# EAGLE design s-isp (EAGLE 7.5.0)
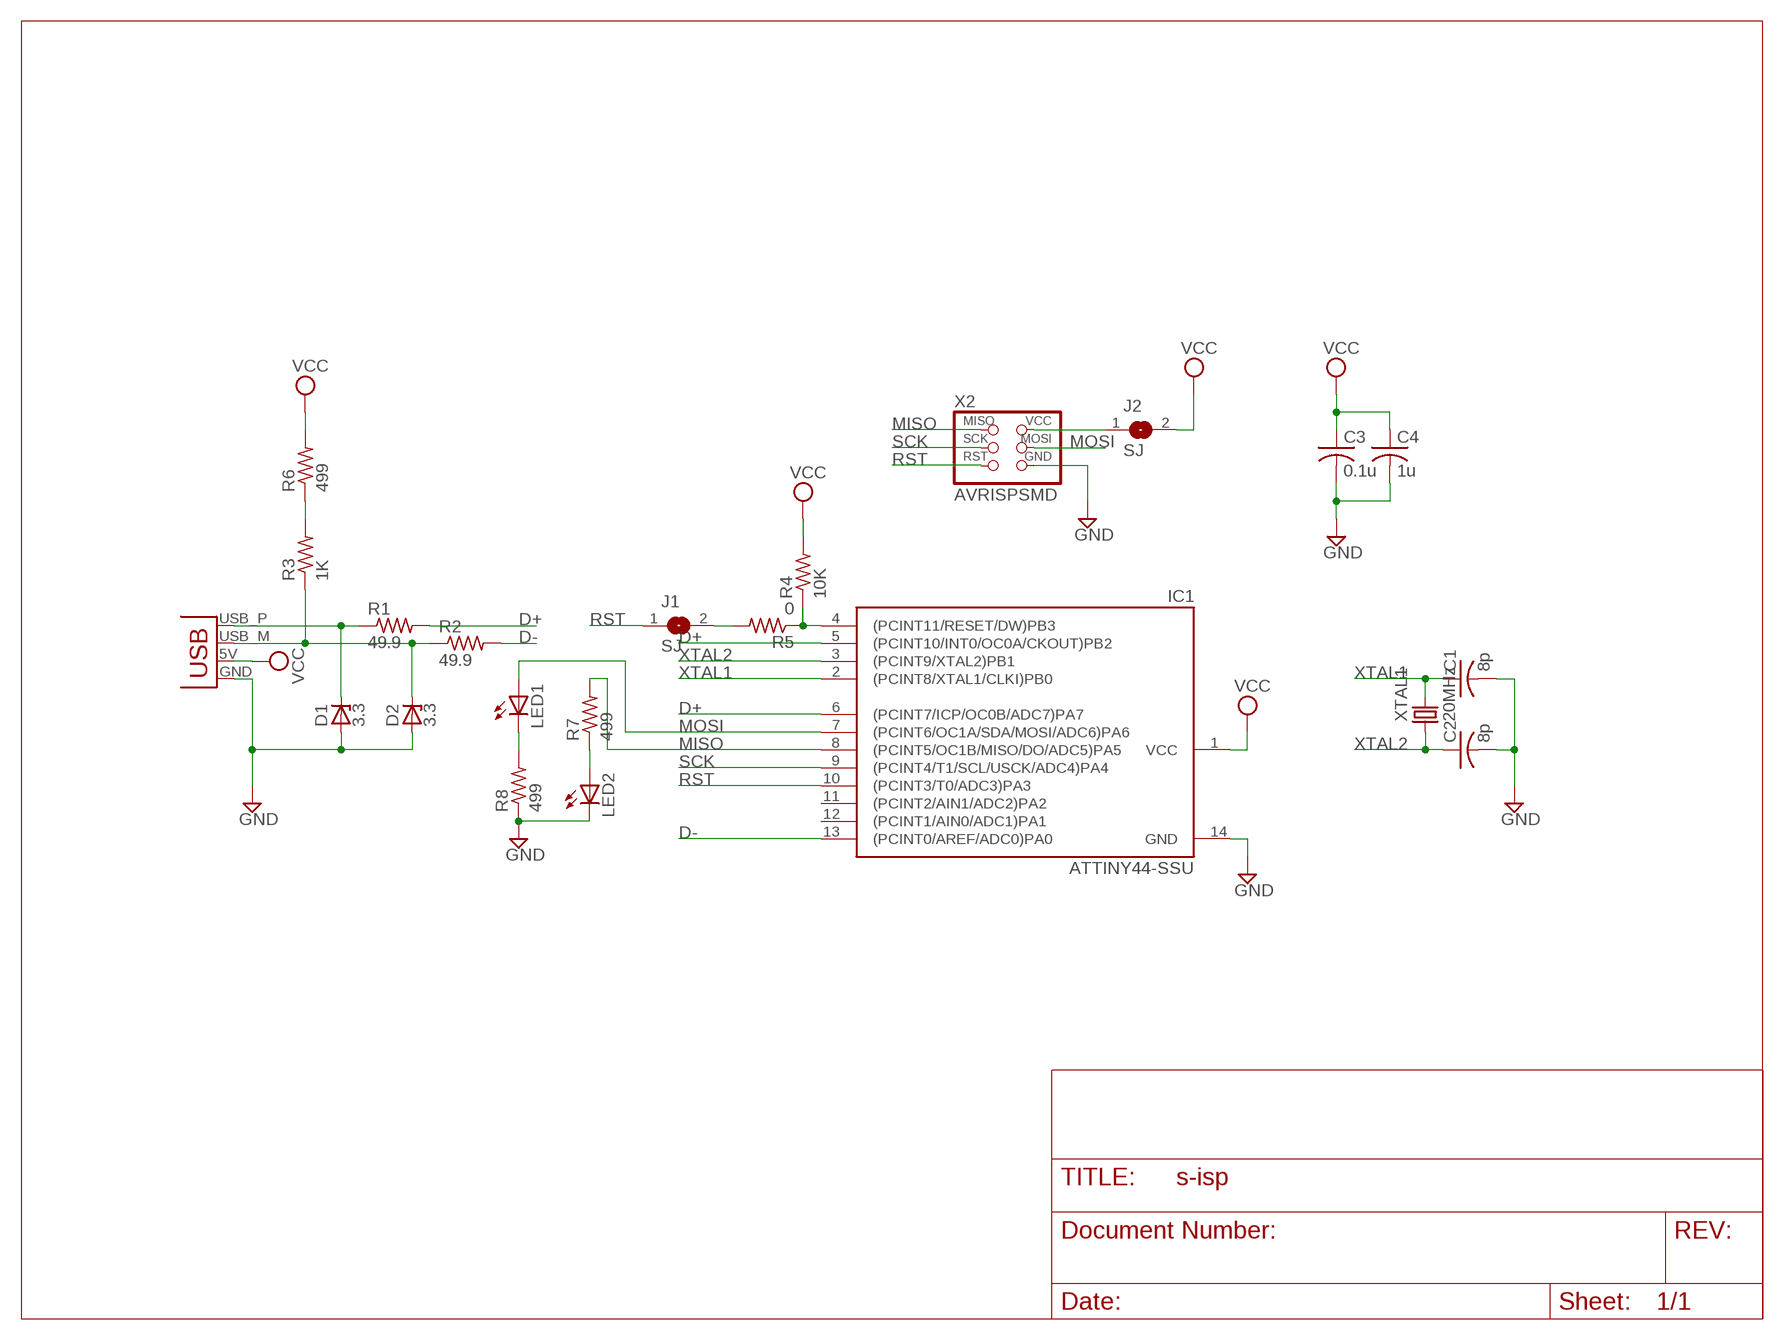
[diagram p0: schematic, sheet 1]

## Parts
C1  8p  C-USC1206  [C1206]
C2  8p  C-USC1206  [C1206]
C3  0.1u  C-USC1206  [C1206]
C4  1u  C-USC1206  [C1206]
D1  3.3  ZENER_DIODESOD123  [SOD123]
D2  3.3  ZENER_DIODESOD123  [SOD123]
IC1  ATTINY44-SSU  [SOIC14]
J1  SJ  SOLDER_JUMPER  [SJFAB]
J2  SJ  SOLDER_JUMPER  [SJFAB]
LED1  LEDSMT1206  [1206]
LED2  LEDSMT1206  [1206]
R1  49.9  R-US_R1206  [R1206]
R2  49.9  R-US_R1206  [R1206]
R3  1K  R-US_R1206  [R1206]
R4  10K  R-US_R1206  [R1206]
R5  0  R-US_R1206  [R1206]
R6  499  R-US_R1206  [R1206]
R7  499  R-US_R1206  [R1206]
R8  499  R-US_R1206  [R1206]
X1  USBPCB  [USB-A-PCB]
X2  AVRISPSMD  [2X03SMD]
XTAL1  20MHz  CRYSTAL  [2-SMD-5X3MM]

## Nets
D+: IC1.5((PCINT10/INT0/OC0A/CKOUT)PB2) IC1.6((PCINT7/ICP/OC0B/ADC7)PA7) R1.2
D-: IC1.13((PCINT0/AREF/ADC0)PA0) R2.2
GND: C1.2 C2.2 C3.2 C4.2 D1.ANODE D2.ANODE IC1.14(GND) LED2.C R8.1 X1.GND X2.6(GND)
MISO: IC1.8((PCINT5/OC1B/MISO/DO/ADC5)PA5) R7.2 X2.1(MISO)
MOSI: IC1.7((PCINT6/OC1A/SDA/MOSI/ADC6)PA6) LED1.A X2.4(MOSI)
N$1: D1.CATHODE R1.1 X1.USB_P(D+)
N$2: D2.CATHODE R2.1 R3.1 X1.USB_M(D-)
N$3: J1.2 R5.2
N$4: J2.1 X2.2(VCC)
N$5: IC1.4((PCINT11/RESET/DW)PB3) R4.1 R5.1
N$6: R3.2 R6.1
N$7: LED1.C R8.2
N$8: LED2.A R7.1
RST: IC1.10((PCINT3/T0/ADC3)PA3) J1.1 X2.5(RST)
SCK: IC1.9((PCINT4/T1/SCL/USCK/ADC4)PA4) X2.3(SCK)
VCC: C3.1 C4.1 IC1.1(VCC) J2.2 R4.2 R6.2 X1.5V(VBUS)
XTAL1: C1.1 IC1.2((PCINT8/XTAL1/CLKI)PB0) XTAL1.P$2
XTAL2: C2.1 IC1.3((PCINT9/XTAL2)PB1) XTAL1.P$1
Unconnected: IC1.11((PCINT2/AIN1/ADC2)PA2) IC1.12((PCINT1/AIN0/ADC1)PA1)

## Library data of the parts
C1-C4 = rcl:C-US: CAPACITOR, American symbol
D1 D2 = fab:ZENER_DIODE: zener diode
IC1 = fab:ATTINY44
J1 J2 = fab:SOLDER_JUMPER
LED1 LED2 = led:LED: LED OSRAM: - CHIPLED LG R971, LG N971, LY N971, LG Q971, LY Q971, LO R971, LY R971 LH N974, LH R974 LS Q976, LO Q976, LY Q976 LO Q996 - Hyper CHIPLED LW Q18S LB Q993, LB Q99A, LB R99A - SideLED LS A670, LO A670, LY A670, LG A670, LP A670 LB A673, LV A673, LT A673, LW A673 LH A674 LY A675 LS A676, LA A676, LO A676, LY A676, LW A676 LS A679, LY A679, LG A679 - Hyper Micro SIDELED® LS Y876, LA Y876, LO Y876, LY Y876 LT Y87S - SmartLED LW L88C, LW L88S LB L89C, LB L89S, LG L890 LS L89K, LO L89K, LY L89K LS L896, LA L896, LO L896, LY L896 - TOPLED LS T670, LO T670, LY T670, LG T670, LP T670 LSG T670, LSP T670, LSY T670, LOP T670, LYG T670 LG T671, LOG T671, LSG T671 LB T673, LV T673, LT T673, LW T673 LH T674 LS T676, LA T676, LO T676, LY T676, LB T676, LH T676, LSB T676, LW T676 LB T67C, LV T67C, LT T67C, LS T67K, LO T67K, LY T67K, LW E67C LS E67B, LA E67B, LO E67B, LY E67B, LB E67C, LV E67C, LT E67C LW T67C LS T679, LY T679, LG T679 LS T770, LO T770, LY T770, LG T770, LP T770 LB T773, LV T773, LT T773, LW T773 LH T774 LS E675, LA E675, LY E675, LS T675 LS T776, LA T776, LO T776, LY T776, LB T776 LHGB T686 LT T68C, LB T68C - Hyper Mini TOPLED® LB M676 - Mini TOPLED Santana® LG M470 LS M47K, LO M47K, LY M47K Source: http://www.osram.convergy.de LUXEON: - LUMILED® LXK2-PW12-R00, LXK2-PW12-S00, LXK2-PW14-U00, LXK2-PW14-V00 LXK2-PM12-R00, LXK2-PM12-S00, LXK2-PM14-U00 LXK2-PE12-Q00, LXK2-PE12-R00, LXK2-PE12-S00, LXK2-PE14-T00, LXK2-PE14-U00 LXK2-PB12-K00, LXK2-PB12-L00, LXK2-PB12-M00, LXK2-PB14-N00, LXK2-PB14-P00, LXK2-PB14-Q00 LXK2-PR12-L00, LXK2-PR12-M00, LXK2-PR14-Q00, LXK2-PR14-R00 LXK2-PD12-Q00, LXK2-PD12-R00, LXK2-PD12-S00 LXK2-PH12-R00, LXK2-PH12-S00 LXK2-PL12-P00, LXK2-PL12-Q00, LXK2-PL12-R00 Source: www.luxeon.com KINGBRIGHT: KA-3528ASYC Source: www.kingbright.com
R1-R8 = rcl:R-US_: RESISTOR, American symbol
X1 = SparkFun:USB: USB Connectors USB-B-PTH is fully proven SKU : PRT-00139 USB-miniB is fully proven SKU : PRT-00587 USB-A-PCB is untested. USB-A-H is throughly reviewed, but untested. Spark Fun Electronics SKU : PRT-00437 USB-B-SMT is throughly reviewed, but untested. Needs silkscreen touching up. USB-A-S has not been used/tested USB-MB-H has not been used/tested
X2 = fab:AVRISP
XTAL1 = fab:CRYSTAL

## Board
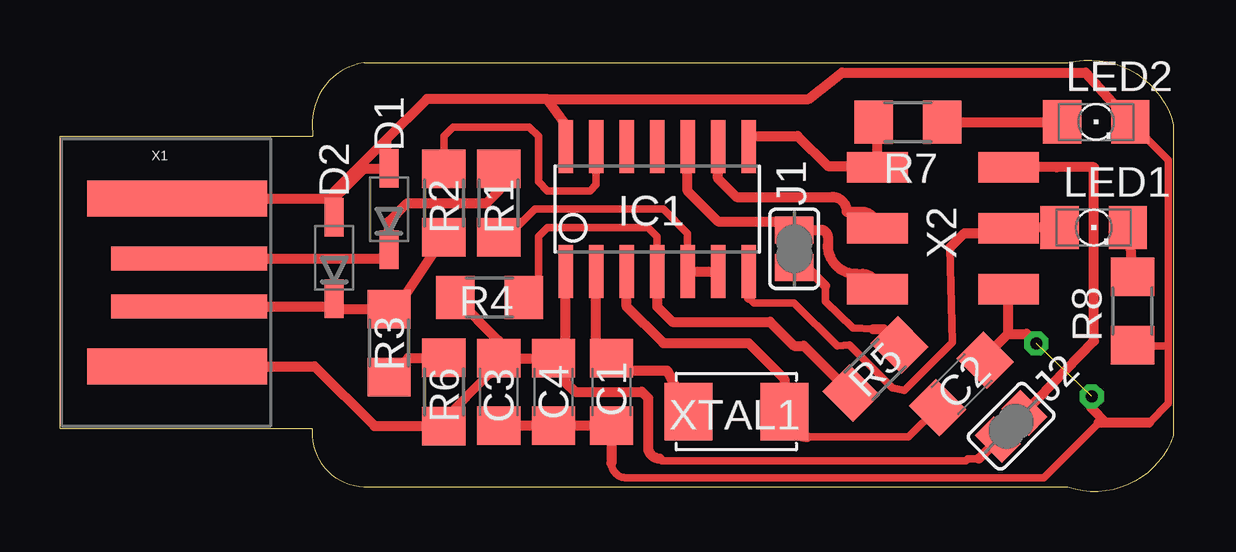
[diagram p1: board, top side]

Size 46.41 x 18.01 mm. Coordinates in mm from the lower left corner, seen from the top.
Outline: 0,2.64 10.54,2.64 10.54,2.51 arc90 12.67,0.18 42.01,0.18 arc90 46.41,2.36 46.41,15.31 arc90 42.01,17.89 12.67,17.89 arc90 10.54,14.96 10.54,14.83 0,14.83 0,2.64
Copper layers (1*16): Top 0.035mm / dielectric 1.5mm / Bottom 0.035mm
Design rules "fab": minimum track width 12mil, minimum drill 0.8mm, track to track 15.5mil, track to pad 15.5mil, pad to pad 15mil, via to via 15mil, smd to smd 10mil, copper to edge 0mil, drill to drill 1mm, minimum pad ring 0.2mm, minimum via ring 0.2mm, stop-mask expansion 4mil, vias tented up to drill 0mil, thermal gap 1mm
tRestrict: 4 lines

### Footprints (pad centres in the part's own frame; a part is rotated, then mirrored left to right if it is on the bottom)
C1206 = smd 1.6 x 1.8: 1 -1.4,0; 2 1.4,0
SOD123 = smd 1.6 x 0.8: ANODE 1.7,0; CATHODE -1.7,0
SOIC14 = smd 0.61 x 2.21: 1 -3.81,-2.603; 2 -2.54,-2.603; 3 -1.27,-2.603; 4 0,-2.603; 5 1.27,-2.603; 6 2.54,-2.603; 7 3.81,-2.603; 8 3.81,2.603; 9 2.54,2.603; 10 1.27,2.603; 11 0,2.603; 12 -1.27,2.603; 13 -2.54,2.603; 14 -3.81,2.603
SJFAB = smd 1.118 x 1.6: 1 -0.787,0; 2 0.787,0
1206 = smd 1.6 x 1.803: A -1.422,0; C 1.422,0
R1206 = smd 1.6 x 1.803: 1 -1.422,0; 2 1.422,0
USB-A-PCB = smd 7.5 x 1.5: 5V -0.2,-3.5; GND -0.2,3.5 | smd 6.5 x 1: USB_M 0.3,-1; USB_P 0.3,1
2X03SMD = smd 2.54 x 1.27: 1 -2.54,2.54; 2 2.92,2.54; 3 -2.54,0; 4 2.92,0; 5 -2.54,-2.54; 6 2.92,-2.54
2-SMD-5X3MM = smd 2 x 2.4: P$1 -2,0; P$2 2,0

### Placement (x,y rotation side)
C1  22.99,4.16 270 top
C2  37.58,4.49 45 top
C3  18.29,4.16 270 top
C4  20.57,4.16 270 top
D1  13.72,11.78 90 top
D2  11.43,9.75 90 top
IC1  24.89,11.78 0 top
J1  30.61,10.13 270 top
J2  39.65,2.73 225 top
LED1  43.09,11.01 0 top
LED2  43.19,15.42 0 top
R1  18.29,12.04 270 top
R2  16,12.04 90 top
R3  13.72,6.19 270 top
R4  17.91,8.1 180 top
R5  33.99,5.11 45 top
R6  16,4.16 270 top
R7  35.34,15.41 180 top
R8  44.7,7.53 90 top
X1  5.08,8.73 0 top
X2  36.62,10.99 0 top
XTAL1  28.19,3.34 180 top

### Tracks (layer width: path | path; a pad name or v marks a point on that pad's centre or on a via)
D+
  Top 0.305: 18.64,10.61 19.81,11.78 25.15,11.78 26.16,10.77 IC1.5
  Top 0.406: IC1.5 IC1.6 | R1.2 18.64,10.61
D-
  Top 0.305: IC1.13 22.35,12.8 22.1,12.54 20.32,12.54 19.94,12.93 19.94,14.83 19.56,15.21 16.38,15.21 16,14.83 R2.2
GND  (via drill 0.5 pad 0.61)  (1 unrouted)
  Top 0.305: 22.99,1.19 arc90 23.6,0.58 41,0.58 43.3,2.88 | 45.4,2.88 46.2,3.68 46.2,6.08 | LED2.C 46.2,13.83 46.2,6.08 | R8.1 44.74,6.08 46.2,6.08
  Top 0.406: X1.GND 11.43,12.23 | 11.43,12.23 D2.ANODE 11.43,12.51 13.6,14.68 | 11.43,12.23 12.68,13.48 D1.ANODE 13.6,13.6 13.6,14.68 | C3.2 C4.2 C1.2 22.99,1.19 | 39.67,8.57 arc90 X2.6 39.5,8.41 39.5,6.58 | 39.5,6.58 38.52,5.6 C2.2 | IC1.14 21.1,14.4 21.1,15.28 20.3,16.38 | 20.3,16.38 15.3,16.38 13.6,14.68 | 20.3,16.38 31.2,16.38 32.6,17.48 42.75,17.48 LED2.C | 45.4,2.88 43.6,2.88 | 43.6,2.88 43.3,2.88 | v43,3.98 43,3.48 43.6,2.88 | 39.5,6.58 40.3,6.58 v40.7,6.18
MISO
  Top 0.406: IC1.8 28.7,14.83 30.75,14.83 32,13.58 34.03,13.58 X2.1 34.08,15.55 R7.2
MOSI
  Top 0.305: 28.7,8.1 28.92,7.88 30.6,7.88 32.4,6.08 32.9,6.13 34.7,4.33 35.2,4.23 37.2,6.23 37.1,10.18
  Top 0.406: 28.7,8.99 IC1.7 28.7,8.1 | LED1.A 39.57,11.01 arc90 X2.4 39.33,10.78 37.7,10.78 37.1,10.18
N$1
  Top 0.406: D1.CATHODE 13.56,10.24 | X1.USB_P 13.37,9.73 D1.CATHODE | R1.1 18.29,12.54 17.78,12.04 14.48,12.04 13.72,11.27 D1.CATHODE
N$2
  Top 0.406: X1.USB_M 11.11,7.73 D2.CATHODE 11.43,7.62 R3.1 14.02,7.62 R2.1
N$3
  Top 0.305: 31.9,8.58 31.9,7.93 33.05,6.83 33.9,6.78
  Top 0.406: J1.2 31.14,9.34 31.9,8.58 | 33.9,6.78 34.33,6.78 R5.2
N$4
  Top 0.406: J2.1 43.1,6.28 43.1,13.53 41.55,13.53 X2.2
N$5
  Top 0.305: IC1.4 24.89,10.64 24.51,11.02 20.32,11.02 19.94,10.64 19.94,8.71 R4.1
  Top 0.406: IC1.4 24.89,7.72 25.53,7.08 29.6,7.08 30.6,6.08 31.01,6.08 R5.1
N$6
  Top 0.406: R6.1 14.53,5.58 R3.2
N$7
  Top 0.406: LED1.C 44.58,10.85 R8.2
N$8
  Top 0.406: R7.1 41.56,15.41 LED2.A
RST
  Top 0.406: IC1.10 26.16,12.54 27.43,11.27 30,11.27 J1.1 31.73,10.92 arc-90 32,10.64 32,10.28 arc90 33.2,9.08 33.45,9.08 arc-90 X2.5
SCK
  Top 0.406: IC1.9 27.43,13.05 28.19,12.29 32.19,12.29 arc-90 32.8,11.68 33.39,11.68 arc-90 X2.3
VCC
  Top 0.305: 25,1.38 25.1,1.28 37.75,1.28 37.85,1.38 38.3,1.38
  Top 0.381: 16,3.02 17.91,4.92
  Top 0.406: 21.08,6.07 IC1.1 | 21.08,6.07 C4.1 C3.1 | X1.5V 10.61,5.23 13.11,2.74 R6.2 16,3.02 | R4.2 18.29,6.3 C3.1 | 21.08,6.07 21.08,4.54 21.46,4.16 24.26,4.16 24.51,3.91 24.51,1.87 arc90 25,1.38 | 17.91,4.92 17.91,5.18 C3.1 | 38.3,1.38 J2.2
XTAL1
  Top 0.406: IC1.2 22.35,6.2 C1.1 23.24,5.56 23.75,5.05 25.3,5.05 XTAL1.P$2
XTAL2
  Top 0.305: C2.1 35.37,2.28 31.15,2.28
  Top 0.406: IC1.3 23.62,7.72 25.15,6.19 28.7,6.19 30.19,4.7 XTAL1.P$1 arc90 31.15,2.28